# Altium schematic sheet 4_CTPT.schdoc
size 307 x 218 mm; Symbol: A4空白; Device: A4空白; @Project Name: 34567890; @Page Count: 7; @Update Date: 2025-05-12; @Create Date: 2025-03-11; @Schematic Name: Schematic1; @Page No: 4; @Page Name: CTPT; @Create Time: 07:05:34; @Board Name: PCB; @Update Time: 12:27:08; Title Block Position: 3; Width: 1170; Height: 825; Region Start: 1; X Region Count: 6; Y Region Count: 4; Blade Width: 10; SheetNumber: 4; SheetTotal: 7
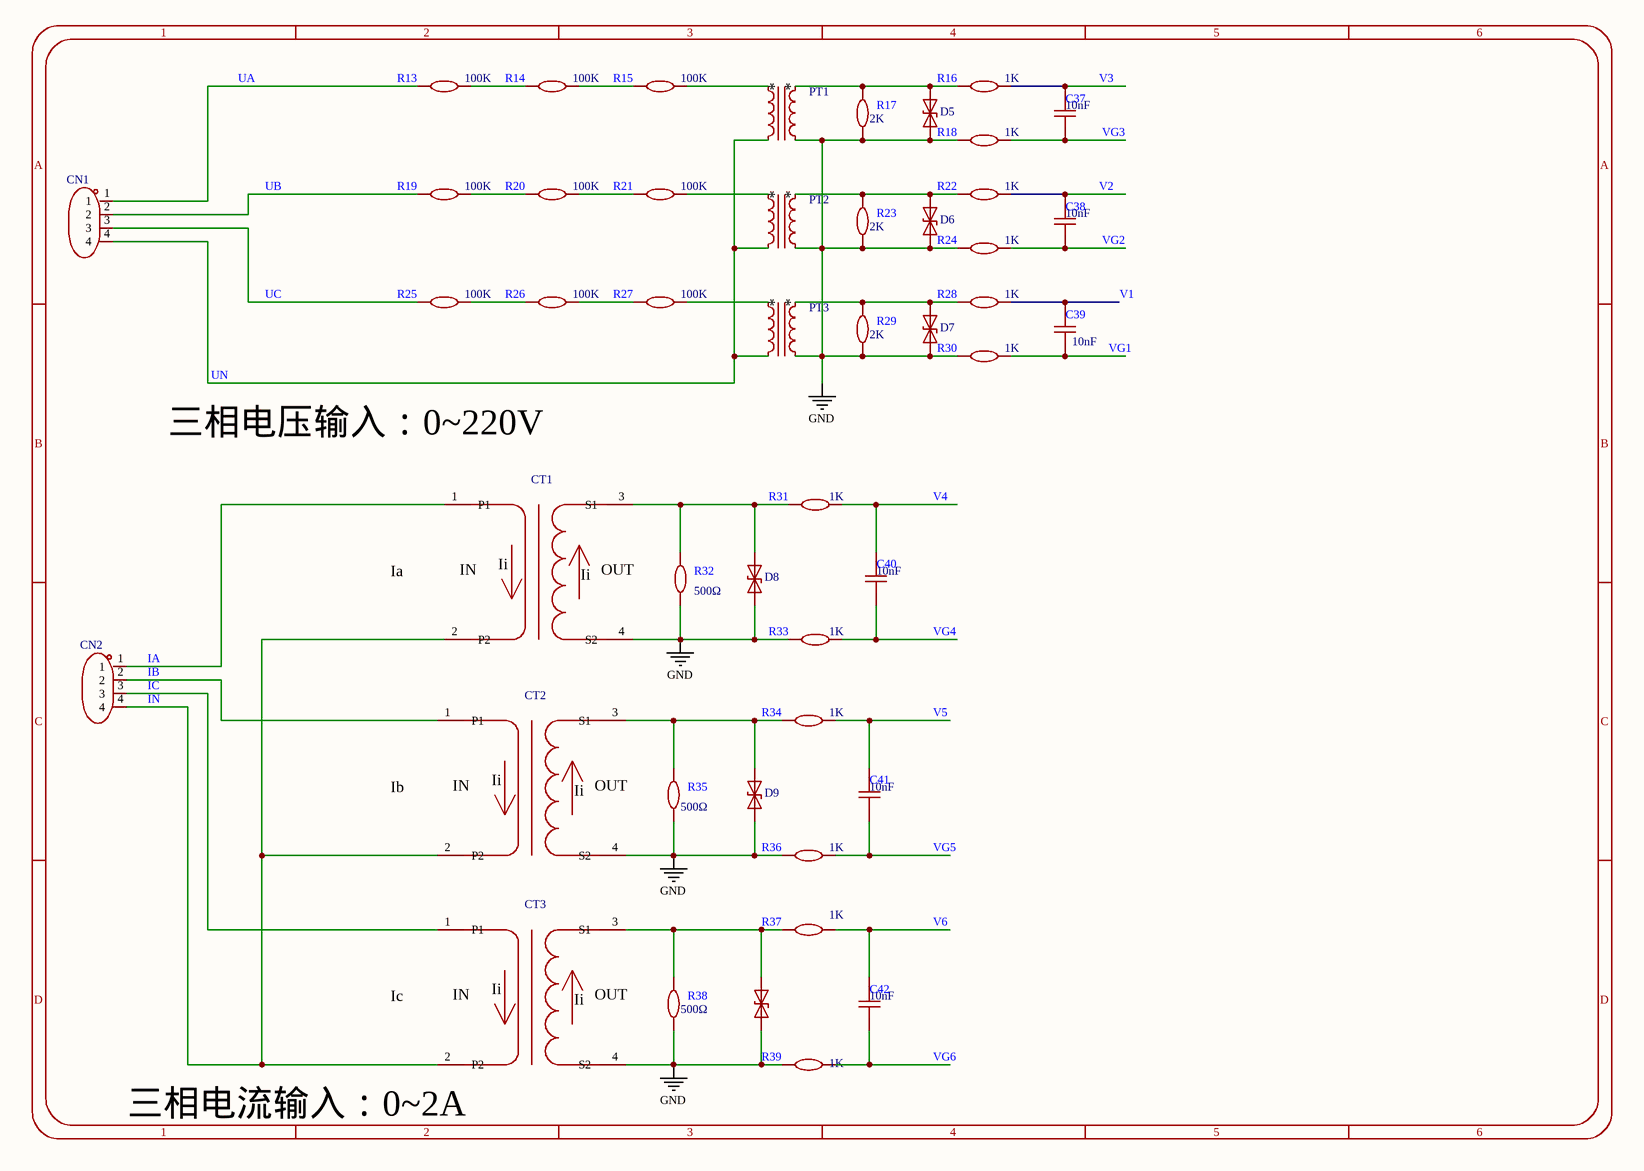
[diagram p0: 4_CTPT.schdoc]

## Parts
C37  10nF  [C0603]
C38  10nF  [C0603]
C39  10nF  [C0603]
C40  10nF  [C0603]
C41  10nF  [C0603]
C42  10nF  [C0603]
CN1  WJ2EDGRC-5.08-4P  [CONN-TH_4P-P5.08_WJ2EDGRC-5.08-4P]  (value not drawn)
CN2  WJ2EDGRC-5.08-4P  [CONN-TH_4P-P5.08_WJ2EDGRC-5.08-4P]  (value not drawn)
CT1  DL-CT21C  [DL-CT21C]  (value not drawn)
CT2  DL-CT21C  [DL-CT21C]  (value not drawn)
CT3  DL-CT21C  [DL-CT21C]  (value not drawn)
D5  SMBJ12CA  [SMB_L4.6-W3.6-LS5.3-BI]  (value not drawn)
D6  SMBJ12CA  [SMB_L4.6-W3.6-LS5.3-BI]  (value not drawn)
D7  SMBJ12CA  [SMB_L4.6-W3.6-LS5.3-BI]  (value not drawn)
D8  SMBJ12CA  [SMB_L4.6-W3.6-LS5.3-BI]  (value not drawn)
D9  SMBJ12CA  [SMB_L4.6-W3.6-LS5.3-BI]  (value not drawn)
D10  SMBJ12CA  [SMB_L4.6-W3.6-LS5.3-BI]  (value not drawn)
PT1  ZMPT107-1  [XFMR-TH_ZMPT107-1]  (value not drawn)
PT2  ZMPT107-1  [XFMR-TH_ZMPT107-1]  (value not drawn)
PT3  ZMPT107-1  [XFMR-TH_ZMPT107-1]  (value not drawn)
R13  100K  [R1206]
R14  100K  [R1206]
R15  100K  [R1206]
R16  1K  [R0603]
R17  2K  [R0603]
R18  1K  [R0603]
R19  100K  [R1206]
R20  100K  [R1206]
R21  100K  [R1206]
R22  1K  [R0603]
R23  2K  [R0603]
R24  1K  [R0603]
R25  100K  [R1206]
R26  100K  [R1206]
R27  100K  [R1206]
R28  1K  [R0603]
R29  2K  [R0603]
R30  1K  [R0603]
R31  1K  [R0603]
R32  500Ω  [R0603]
R33  1K  [R0603]
R34  1K  [R0603]
R35  500Ω  [R0603]
R36  1K  [R0603]
R37  1K  [R0603]
R38  500Ω  [R0603]
R39  1K  [R0603]

## Nets
GND: CT1.4(S2) CT2.4(S2) CT3.4(S2) D5.2(A) D6.2(A) D7.2(A) D8.2(A) D9.2(A) D10.2(A) PT1.4 PT2.4 PT3.4 R17.1 R18.1 R23.1 R24.1 R29.1 R30.1 R32.1 R33.1 R35.1 R36.1 R38.1 R39.1
IA: CN2.1 CT1.1(P1)
IB: CN2.2 CT2.1(P1)
IC: CN2.3 CT3.1(P1)
IN: CN2.4 CT1.2(P2) CT2.2(P2) CT3.2(P2)
UA: CN1.1 R13.1
UB: CN1.2 R19.1
UC: CN1.3 R25.1
UN: CN1.4 PT1.2 PT2.2 PT3.2
V1: C39.2 R28.2
V2: C38.2 R22.2
V3: C37.2 R16.2
V4: C40.2 R31.2
V5: C41.2 R34.2
V6: C42.2 R37.2
VG1: C39.1 R30.2
VG2: C38.1 R24.2
VG3: C37.1 R18.2
VG4: C40.1 R33.2
VG5: C41.1 R36.2
VG6: C42.1 R39.2
NetCT1_3: CT1.3(S1) D8.1(K) R31.1 R32.2
NetCT2_3: CT2.3(S1) D9.1(K) R34.1 R35.2
NetCT3_3: CT3.3(S1) D10.1(K) R37.1 R38.2
NetD5_1: D5.1(K) PT1.3 R16.1 R17.2
NetD6_1: D6.1(K) PT2.3 R22.1 R23.2
NetD7_1: D7.1(K) PT3.3 R28.1 R29.2
NetPT1_1: PT1.1 R15.2
NetPT2_1: PT2.1 R21.2
NetPT3_1: PT3.1 R27.2
NetR13_2: R13.2 R14.1
NetR14_2: R14.2 R15.1
NetR19_2: R19.2 R20.1
NetR20_2: R20.2 R21.1
NetR25_2: R25.2 R26.1
NetR26_2: R26.2 R27.1

## Notes on the sheet
- 三相电压输入：0~220V
- Ia
- Ib
- Ic
- 三相电流输入：0~2A
- 1
- 2
- 3
- 4
- 5
- 6
- A
- B
- C
- D
- (in symbol DL-CT21C) Ii; IN; OUT

## Library data of the parts
C37-C42 = CAP_0603: Device: CAP_0603
PT1-PT3 = ZMPT107-1_C125191: Device: ZMPT107-1_C125191
R13-R15 R19-R21 R25-R27 = Res_1206: Device: Res_1206
R16-R18 R22-R24 R28-R39 = Res_0603: Device: Res_0603
CN1 CN2 = WJ2EDGRC-5.08-4P: Device: WJ2EDGRC-5.08-4P
CT1-CT3 = DL-CT21C: Device: DL-CT21C
D5-D10 = SMBJ12CA: Device: SMBJ12CA